# EAGLE design Qwiic_Adaptive_Switch_Output (EAGLE 9.6.2)
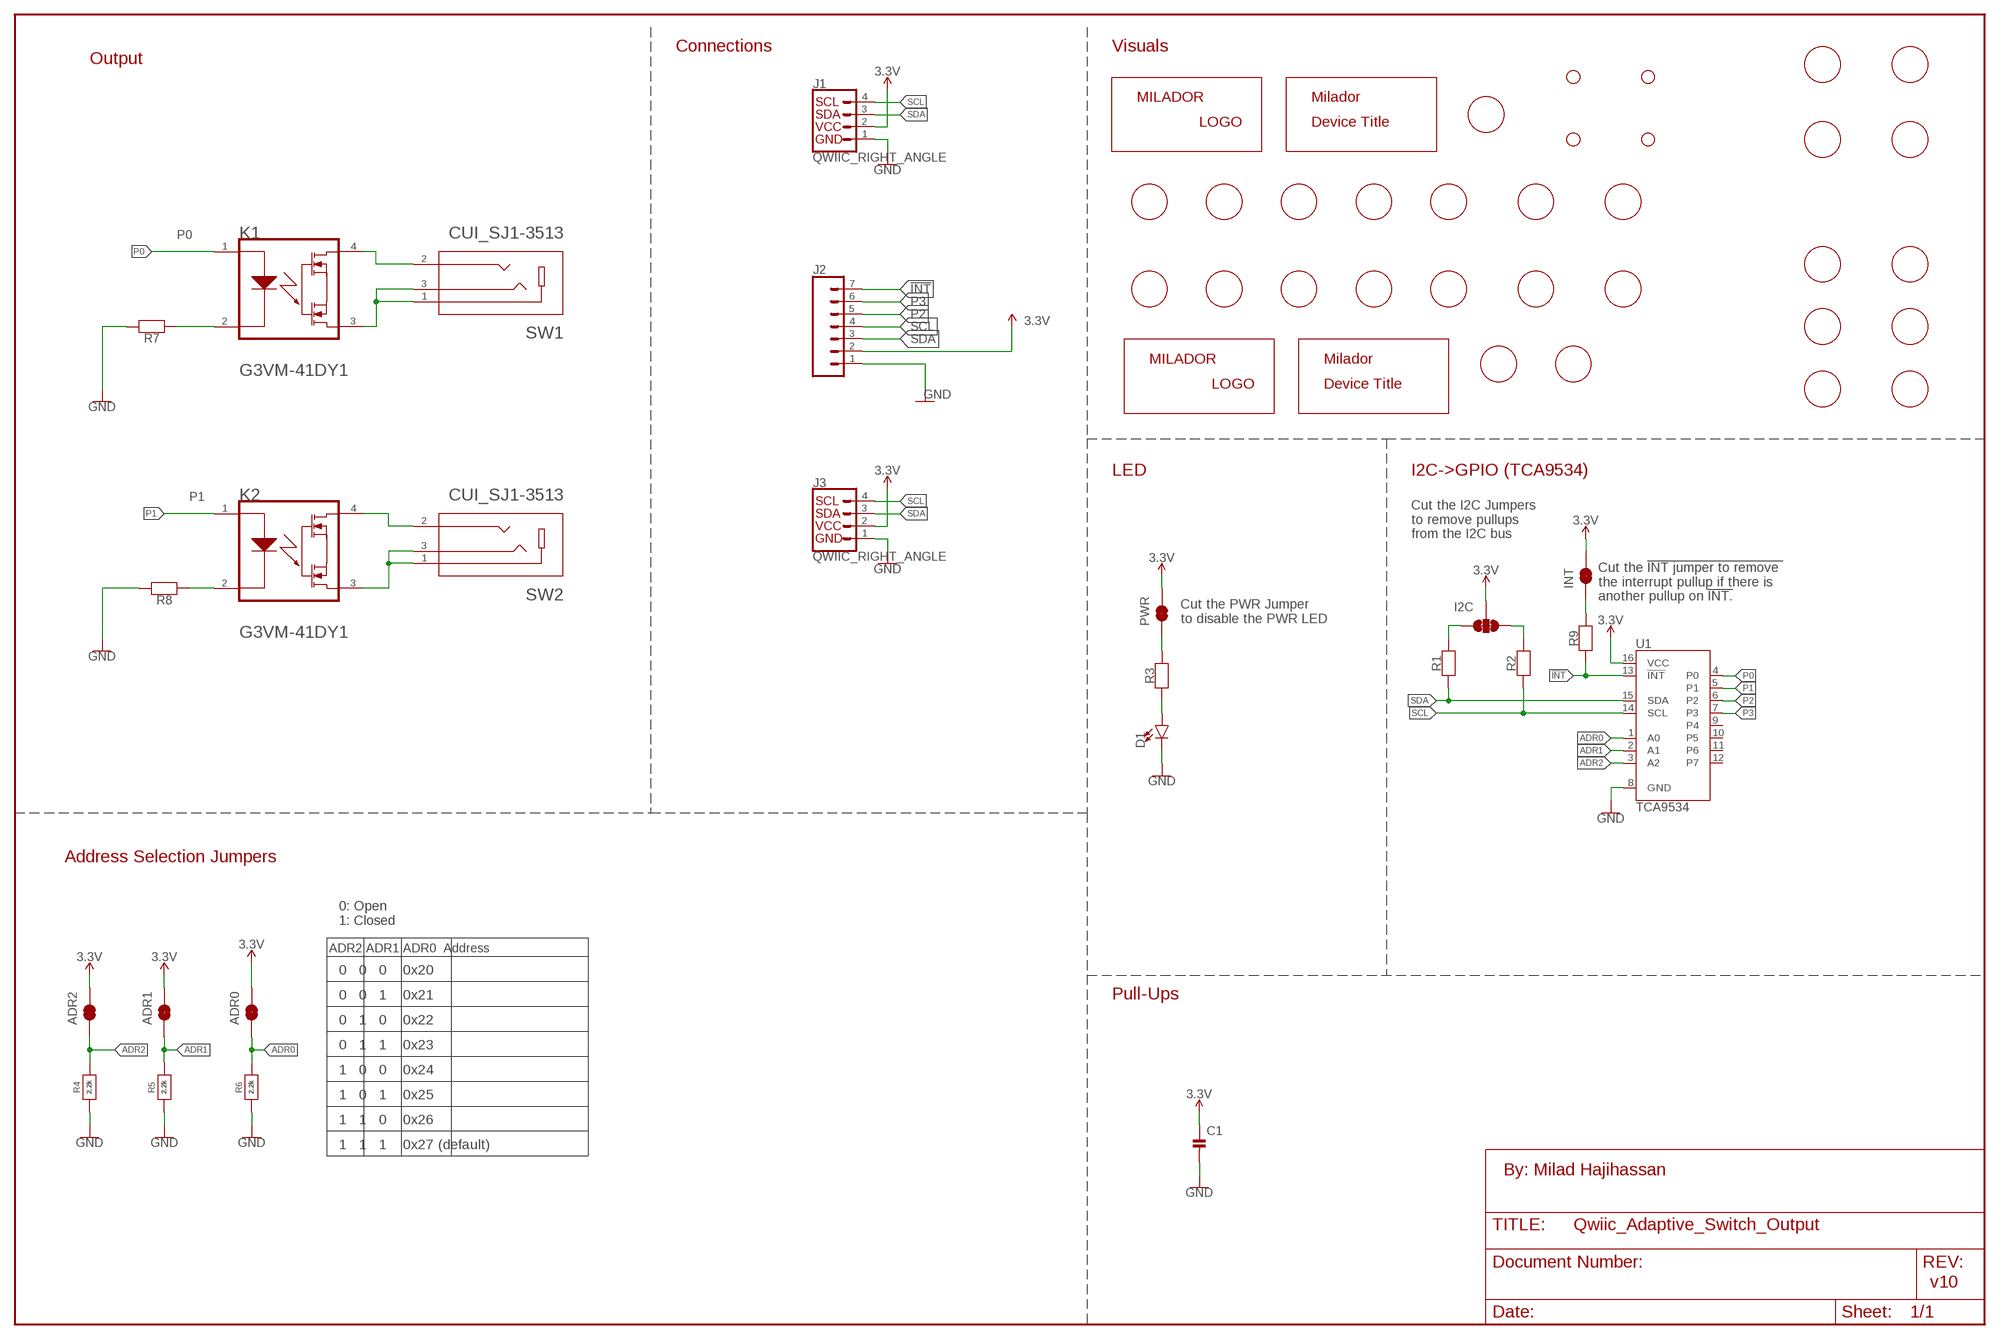
[diagram p0: schematic, sheet 1]

## Parts
ADR0  JUMPERS-SMT_2_NC_TRACE_SILK  [JUMPERS_SMT-JUMPER_2_NC_TRACE_SILK]
ADR1  JUMPERS-SMT_2_NC_TRACE_SILK  [JUMPERS_SMT-JUMPER_2_NC_TRACE_SILK]
ADR2  JUMPERS-SMT_2_NC_TRACE_SILK  [JUMPERS_SMT-JUMPER_2_NC_TRACE_SILK]
C1  0.1uF  CAP_CERAMIC-0805-MP  [0805-MP]
D1  RED  LED0805_NOOUTLINE  [CHIPLED_0805_NOOUTLINE]
H1  STAND-OFF-3.3  [STAND-OFF-3.3]
H2  STAND-OFF-3.3  [STAND-OFF-3.3]
H3  STAND-OFF-3.3  [STAND-OFF-3.3]
H4  STAND-OFF-3.3  [STAND-OFF-3.3]
I2C  JUMPERS_JUMPER-SMT_3_2-NC_TRACE_SILK  [JUMPERS_SMT-JUMPER_3_2-NC_TRACE_SILK]
INT  JUMPERS-SMT_2_NC_TRACE_SILK  [JUMPERS_SMT-JUMPER_2_NC_TRACE_SILK]
J1  QWIIC_RIGHT_ANGLE  QWIIC_CONNECTORSJS-1MM  [CONNECTORS_JST04_1MM_RA]
J2  CONNECTORS_CONN_071X07_NO_SILK  [CONNECTORS_1X07_NO_SILK]
J3  QWIIC_RIGHT_ANGLE  QWIIC_CONNECTORSJS-1MM  [CONNECTORS_JST04_1MM_RA]
K1  G3VM-41DY1  [G3VM-41DY1]
K2  G3VM-41DY1  [G3VM-41DY1]
LABE_SCL_BOTTOM  MILADOR-LABEL-SCL  [LABEL-SCL]
LABE_SCL_TOP  MILADOR-LABEL-SCL  [LABEL-SCL]
LABE_SDA_BOTTOM  MILADOR-LABEL-SDA  [LABEL-SDA]
LABE_SDA_TOP  MILADOR-LABEL-SDA  [LABEL-SDA]
LABEL_3V_BOTTOM  MILADOR-LABEL-3V  [LABEL-3V]
LABEL_3V_TOP  MILADOR-LABEL-3V  [LABEL-3V]
LABEL_!INT_BOTTOM  MILADOR-LABEL-!INT  [LABEL-!INT]
LABEL_!INT_TOP  MILADOR-LABEL-!INT  [LABEL-!INT]
LABEL_ADR0  MILADOR-LABEL-ADR0  [LABEL-ADR0]
LABEL_ADR1  MILADOR-LABEL-ADR1  [LABEL-ADR1]
LABEL_ADR2  MILADOR-LABEL-ADR2  [LABEL-ADR2]
LABEL_GND_BOTTOM  MILADOR-LABEL-GND  [LABEL-GND]
LABEL_GND_TOP  MILADOR-LABEL-GND  [LABEL-GND]
LABEL_I2C  MILADOR-LABEL-I2C  [LABEL-I2C]
LABEL_I2C_ADDRESS  MILADOR-LABEL-ADDRESS-0X27  [LABEL-ADDRESS-27]
LABEL_INT  MILADOR-LABEL-INT  [LABEL-INT]
LABEL_MILADOR_BOTTOM  MILADOR-LOGO-  [MILADOR_LOGO1]
LABEL_MILADOR_TOP  MILADOR-LOGO-  [MILADOR_LOGO1]
LABEL_OUTPUT_BOTTOM  MILADOR-SWITCH-NAME-SW-OUTPUT  [SWITCH-OUTPUT]
LABEL_OUTPUT_TOP  MILADOR-SWITCH-NAME-SW-OUTPUT  [SWITCH-OUTPUT]
LABEL_P0_BOTTOM  MILADOR-LABEL-P0  [LABEL-P0]
LABEL_P1_BOTTOM  MILADOR-LABEL-P1  [LABEL-P1]
LABEL_P2_BOTTOM  MILADOR-LABEL-P2  [LABEL-P2]
LABEL_P2_TOP  MILADOR-LABEL-P2  [LABEL-P2]
LABEL_P3_BOTTOM  MILADOR-LABEL-P3  [LABEL-P3]
LABEL_P3_TOP  MILADOR-LABEL-P3  [LABEL-P3]
LABEL_PWR  MILADOR-LABEL-PWR  [LABEL-PWR]
LABEL_SW1  MILADOR-SWITCH-NAME-SW1  [SWITCH-SW1]
LABEL_SW2  MILADOR-SWITCH-NAME-SW2  [SWITCH-SW2]
LABEL_TITLE_BOTTOM  MILADOR-DEVICE-QWIIC-SWITCH  [MILADOR_QWIIC_SWITCH]
LABEL_TITLE_TOP  MILADOR-DEVICE-QWIIC-SWITCH-SM  [MILADOR_QWIIC_SWITCH_SM]
PWR  JUMPERS-SMT_2_NC_TRACE_SILK  [JUMPERS_SMT-JUMPER_2_NC_TRACE_SILK]
R1  2.2k  RESISTOR-0805-MP  [0805-MP]
R2  2.2k  RESISTOR-0805-MP  [0805-MP]
R3  1k  RESISTOR-0805-MP  [0805-MP]
R4  2.2k  RESISTOR-0805-MP  [0805-MP]
R5  2.2k  RESISTOR-0805-MP  [0805-MP]
R6  2.2k  RESISTOR-0805-MP  [0805-MP]
R7  220  RESISTOR-0805-MP  [0805-MP]
R8  220  RESISTOR-0805-MP  [0805-MP]
R9  10k  RESISTOR-0805-MP  [0805-MP]
SW1  CUI_SJ1-3513  [CUI_SJ1-3513]
SW2  CUI_SJ1-3513  [CUI_SJ1-3513]
U1  TCA9534  TCA9534DWR  [16SOIC]

## Nets
3.3V: ADR0.2 ADR1.2 ADR2.2 C1.1 I2C.2 INT.2 J1.2 J2.2 J3.2 PWR.2 U1.16(VCC)
!INT: J2.7 R9.1 U1.13(!INT)
ADR0: ADR0.1 R6.2 U1.1(A0)
ADR1: ADR1.1 R5.2 U1.2(A1)
ADR2: ADR2.1 R4.2 U1.3(A2)
GND: C1.2 D1.C J1.1 J2.1 J3.1 R4.1 R5.1 R6.1 R7.2 R8.2 U1.8(GND)
N$1: INT.1 R9.2
N$2: D1.A R3.1
N$3: PWR.1 R3.2
N$4: K1.4 SW1.2
N$5: K1.2 R7.1
N$6: K1.3 SW1.1 SW1.3
N$7: K2.2 R8.1
N$8: K2.4 SW2.2
N$9: K2.3 SW2.1 SW2.3
P0: K1.1 U1.4(P0)
P1: K2.1 U1.5(P1)
P2: J2.5 U1.6(P2)
P3: J2.6 U1.7(P3)
SCL: J1.4 J2.4 J3.4 R2.1 U1.14(SCL)
SCL_PU1: I2C.1 R1.2
SDA: J1.3 J2.3 J3.3 R1.1 U1.15(SDA)
SDA_PU1: I2C.3 R2.2
Unconnected: U1.9(P4) U1.10(P5) U1.11(P6) U1.12(P7)

## Notes on the sheet
- Connections | Visuals
- Output
- LED | I2C->GPIO (TCA9534)
- Cut the I2C Jumpers 
  to remove pullups 
  from the I2C bus
- Cut the !INT jumper to remove 
  the interrupt pullup if there is 
  another pullup on !INT.
- Cut the PWR Jumper
  to disable the PWR LED
- Address Selection Jumpers
- 0: Open
  1: Closed
- ADR2 ADR1 ADR0  Address
- 0   0   0    0x20
- 0   0   1    0x21 | Pull-Ups
- 0   1   0    0x22
- 0   1   1    0x23
- 1   0   0    0x24
- 1   0   1    0x25
- 1   1   0    0x26
- 1   1   1    0x27 (default)
- By: Milad Hajihassan
- v10

## Library data of the parts
ADR0 ADR1 ADR2 INT PWR = milador_SMD:JUMPERS-SMT_2_NC_TRACE: Normally closed trace jumper This jumper has a trace between two pads so it's normally closed (NC). Use a razor knife to open the connection. For best results follow the IPC guidelines for cutting traces: Cutout at least 0.063 mm (0.005 in). Remove all loose material to clean up the cut area. Seal the cut with an approved epoxy. Reapply solder to reclose the connection.
C1 = milador_SMD:CAP_CERAMIC-: Ceramic Capacitors For new designs, use the packages preceded by an '_' character since they are more reliable: The following footprints should be used on most boards: _0402 - Standard footprint for regular board layouts _0603 - Standard footprint for regular board layouts _0805 - Standard footprint for regular board layouts _1206 - Standard footprint for regular board layouts For extremely tight-pitch boards where space is at a premium, the following 'micro-pitch' footprints can be used (smaller pads, no silkscreen outline, etc.): _0402MP - Micro-pitch footprint for very dense/compact boards _0603MP - Micro-pitch footprint for very dense/compact boards _0805MP - Micro-pitch footprint for very dense/compact boards _1206MP - Micro-pitch footprint for very dense/compact boards
D1 = milador_SMD:LED: LED 0603 - 0603 Surface Mount Package 2mA: Green LED - Low Power (3.9mcd, 2ma, 1.7Vf) - Digikey: 475-2709-2-ND Orange LED - Low Power (9.8mcd, 2ma, 1.8Vf) - Digikey: 475-1194-2-ND Red LED - Low Power (5mcd, 2ma, 1.8Vf) - Digikey: 475-1195-2-ND Yellow LED - Low Power (7mcd, 2ma, 1.8Vf) - Digikey: 475-1196-2-ND 5mA: Blue LED - Low Power (17mcd, 5ma, 2.9Vf) - Digikey: LNJ937W8CRACT-ND 0805 - 0805 Surface Mount Package 2mA: Red LED (8.8mcd, 2mA, 1.8Vf, Clear) - Low Power [Digikey: 475-2510-1-ND] Green LED (5mcd, 2mA, 1.8Vf, Clear) - Low Power [Digikey: 475-2730-1-ND] Yellow LED (11.3mcd, 2mA, 1.8Vf, Clear) - Low Power [Digikey: 475-2555-1-ND] 20mA: Red LED (104mcd, 20mA, Diffused) - LS R976 [Digikey: 475-1278-6-ND] Red LED (12mcd, 20mA, 2.0Vf, Clear) - APT2012EC [Digikey: 754-1128-1-ND] Green LED (15mcd, 20mA, 2.2Vf, Clear) - APT2012GC [Digikey: 754-1131-1-ND] Orange LED (160mcd, 20mA, 2.1Vf, Clear) - APT2012SECK [Digikey: 754-1130-1-ND] 1206 - 1206 Surface Mount Package Green LED (26mcd, 20mA, Diffused) - LG N971 [Digikey: 475-1407-6-ND] Red LED (15mcd, 20mA, Diffused) - LH N974 [Digikey: 475-1416-6-ND] Cree - Cree High-Power Surface Mount LEDs XPEBWT-L1-0000-00D50 - White 111lm 350mA 2.9Vf 6200K 110° XTEAWT-00-0000-00000LEE3 - White 114lm 350mA 2.85Vf 5000K 115° Everlight - Everlight 45-21 Series Surface Mount LEDs 45-21/QK2C-B2832AC2CB2/2T - Warm White 2000mcd 20mA 3.25Vf 3050K 120° 45-21/LK2C-B38452C4CB2/2T - Nuetral White 2000mcd 20mA 3.25Vf 4150K 120° 45-21/LK2C-B50634C6CB2/2T - Cold White 2200mcd 20mA 3.25Vf 5650K 120° PLCC2 Reverse Mount LS T77K-J1L2-1-0-2-R18-Z - Red 11.25mcd 2mA 1.8Vf 630nm 120° LO T77K-L1M2-24-Z - Orange 19.6mcd 2mA 1.8Vf 606nm 120° LY T77K-K2M1-26-Z - Yellow 15.7mcd 2mA 1.8Vf 587nm 120°
H1-H4 = milador:STAND-OFF-: Stand Off Drill holes for mechanically mounting via screws, standoffs, etc. Note: Use the keepout ring to avoid running the screw head into surrounding components. Variant Overviews STAND-OFF - Mechanical footprint for a #4 phillips button head screw. STAND-OFF-TIGHT - Mechanical footprint for a #4 phillips button head screw, Example SparkFun Products Screw - Phillips Head (1/4", 4-40, 10 pack) <https://www.sparkfun.com/products/10453> (PRT-10453) Screw - Phillips Head (1/2", 4-40, 10 pack) <https://www.sparkfun.com/products/10452> (PRT-10452) Screw - Phillips Head (3/4", 4-40, 10 pack) <https://www.sparkfun.com/products/10451> (PRT-10451) Screw - Phillips Head (1", 4-40, 10 pack) <https://www.sparkfun.com/products/10450> (PRT-10450)
I2C = milador_SMD:JUMPERS_JUMPER-SMT_3_2-NC_TRACE: Normally closed trace jumper (2 of 2 connections) This jumper has a trace between all three pads so they are normally closed (NC). Use a razor knife to open the connection(s). For best results follow the IPC guidelines for cutting traces: Cutout at least 0.063 mm (0.005 in). Remove all loose material to clean up the cut area. Seal the cut with an approved epoxy. Reapply solder to reclose the connection(s).
J1 J3 = milador_SMD:QWIIC_CONNECTORS: SparkFun I2C Standard Qwiic Connector An SMD 1mm pitch JST connector makes it easy and quick (get it? Qwiic?) to connect I2C devices to each other. The Qwiic system <http://www.sparkfun.com/qwiic> enables fast and solderless connection between popular platforms and various sensors and actuators. We carry 200mm <https://www.sparkfun.com/products/14204>, 100mm <https://www.sparkfun.com/products/14205>, 50mm <https://www.sparkfun.com/products/14206>, and breadboard friendly <https://www.sparkfun.com/products/14207> Qwiic cables. We also offer 10 pcs strips <https://www.sparkfun.com/products/14323> the SMD connectors.; PROD_ID: CONN-13694
J2 = milador:CONNECTORS_CONN_07: Multi connection point. Often used as Generic Header-pin footprint for 0.1 inch spaced/style header connections On any of the 0.1 inch spaced packages, you can populate with these: Break Away Headers - Straight <https://www.sparkfun.com/products/116> (PRT-00116) Break Away Male Headers - Right Angle <https://www.sparkfun.com/products/553> (PRT-00553) Female Headers <https://www.sparkfun.com/products/115> (PRT-00115) Break Away Headers - Machine Pin <https://www.sparkfun.com/products/117> (PRT-00117) Break Away Female Headers - Swiss Machine Pin <https://www.sparkfun.com/products/743> (PRT-00743) For SCREWTERMINALS and SPRING TERMINALS visit here: Screw Terimnals on SparkFun.com <https://www.sparkfun.com/search/results?term=Screw+Terminals> (5mm/3.5mm/2.54mm spacing) This device is also useful as a general connection point to wire up your design to another part of your project. Our various solder wires solder well into these plated through hole pads. Hook-Up Wire - Assortment (Stranded, 22 AWG) <https://www.sparkfun.com/products/11375> (PRT-11375) Hook-Up Wire - Assortment (Solid Core, 22 AWG) <https://www.sparkfun.com/products/11367> (PRT-11367) View the entire wire category on our website here <https://www.sparkfun.com/categories/141> Special notes: Molex polarized connector foot print use with SKU : PRT-08231 with associated crimp pins and housings. 1MM SMD Version SKU: PRT-10208
K1 K2 = milador_SMD:G3VM-41DY1: G3VM-41DY1(TR05)
LABE_SCL_BOTTOM LABE_SCL_TOP LABE_SDA_BOTTOM LABE_SDA_TOP LABEL_3V_BOTTOM LABEL_3V_TOP LABEL_!INT_BOTTOM LABEL_!INT_TOP LABEL_ADR0 LABEL_ADR1 LABEL_ADR2 LABEL_GND_BOTTOM LABEL_GND_TOP LABEL_I2C LABEL_I2C_ADDRESS LABEL_INT LABEL_P0_BOTTOM LABEL_P1_BOTTOM LABEL_P2_BOTTOM LABEL_P2_TOP LABEL_P3_BOTTOM LABEL_P3_TOP LABEL_PWR = milador:MILADOR-LABEL-
LABEL_MILADOR_BOTTOM LABEL_MILADOR_TOP = milador:MILADOR-LOGO-
LABEL_OUTPUT_BOTTOM LABEL_OUTPUT_TOP LABEL_SW1 LABEL_SW2 = milador:MILADOR-SWITCH-NAME-
LABEL_TITLE_BOTTOM LABEL_TITLE_TOP = milador:MILADOR-DEVICE-
R1-R9 = milador_SMD:RESISTOR-: Resistors For new designs, use the packages preceded by an '_' character since they are more reliable: The following footprints should be used on most boards: _0402 - Standard footprint for regular board layouts _0603 - Standard footprint for regular board layouts _0805 - Standard footprint for regular board layouts _1206 - Standard footprint for regular board layouts For extremely tight-pitch boards where space is at a premium, the following 'micro-pitch' footprints can be used (smaller pads, no silkscreen outline, etc.): _0402MP - Micro-pitch footprint for very dense/compact boards _0603MP - Micro-pitch footprint for very dense/compact boards _0805MP - Micro-pitch footprint for very dense/compact boards _1206MP - Micro-pitch footprint for very dense/compact boards
SW1 SW2 = MMC Eagle:CUI_SJ1-3513: SJ1-3513 3.50mm (0.141", 1/8", Mini Plug) - Headphone Phone Jack Stereo (3 Conductor, TRS) Connector. You can use these as jacks to create simple switch interfaces. Options: Digikey - CP1-3513-ND <https://www.digikey.ca/en/products/detail/SJ1-3513/CP1-3513-ND/738683> Mouser - 490-SJ1-3513 <https://www.mouser.ca/ProductDetail/CUI-Devices/SJ1-3513?qs=WyjlAZoYn505QJhcTd1fzA==>
U1 = milador_SMD:TCA9534: Texas Instruments TCA9534 I2C -> GPIO Expander This I2C -> GPIO Expander allows you to attach 8 GPIO to your I2C bus. With 8 different addresses, up to 64 GPIO are possible on one I2C bus; PROD_ID: IC-14889

## Board
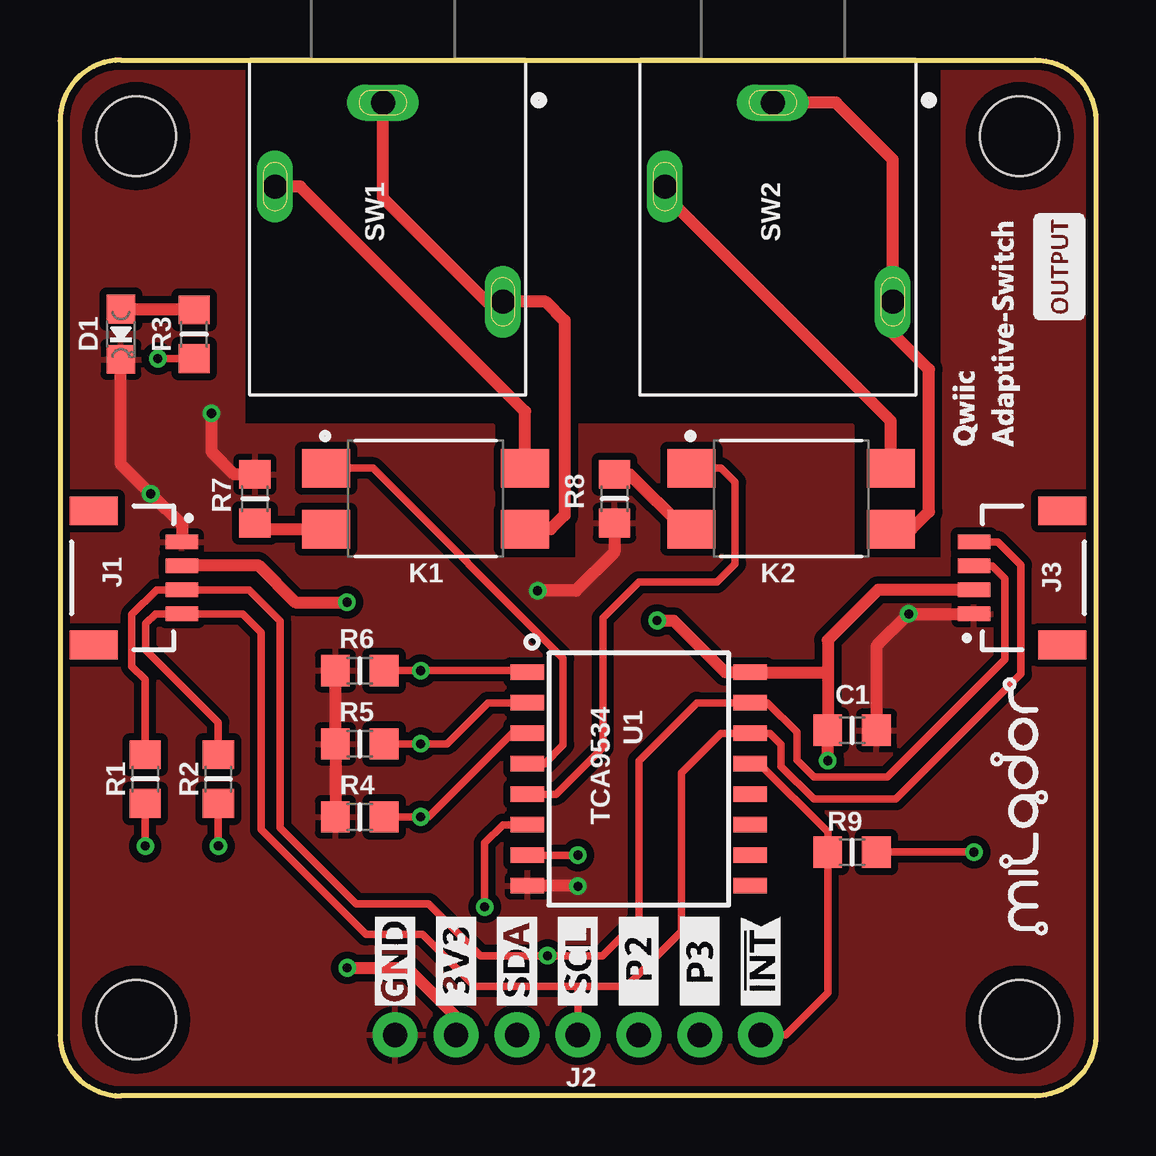
[diagram p1: board, top side]
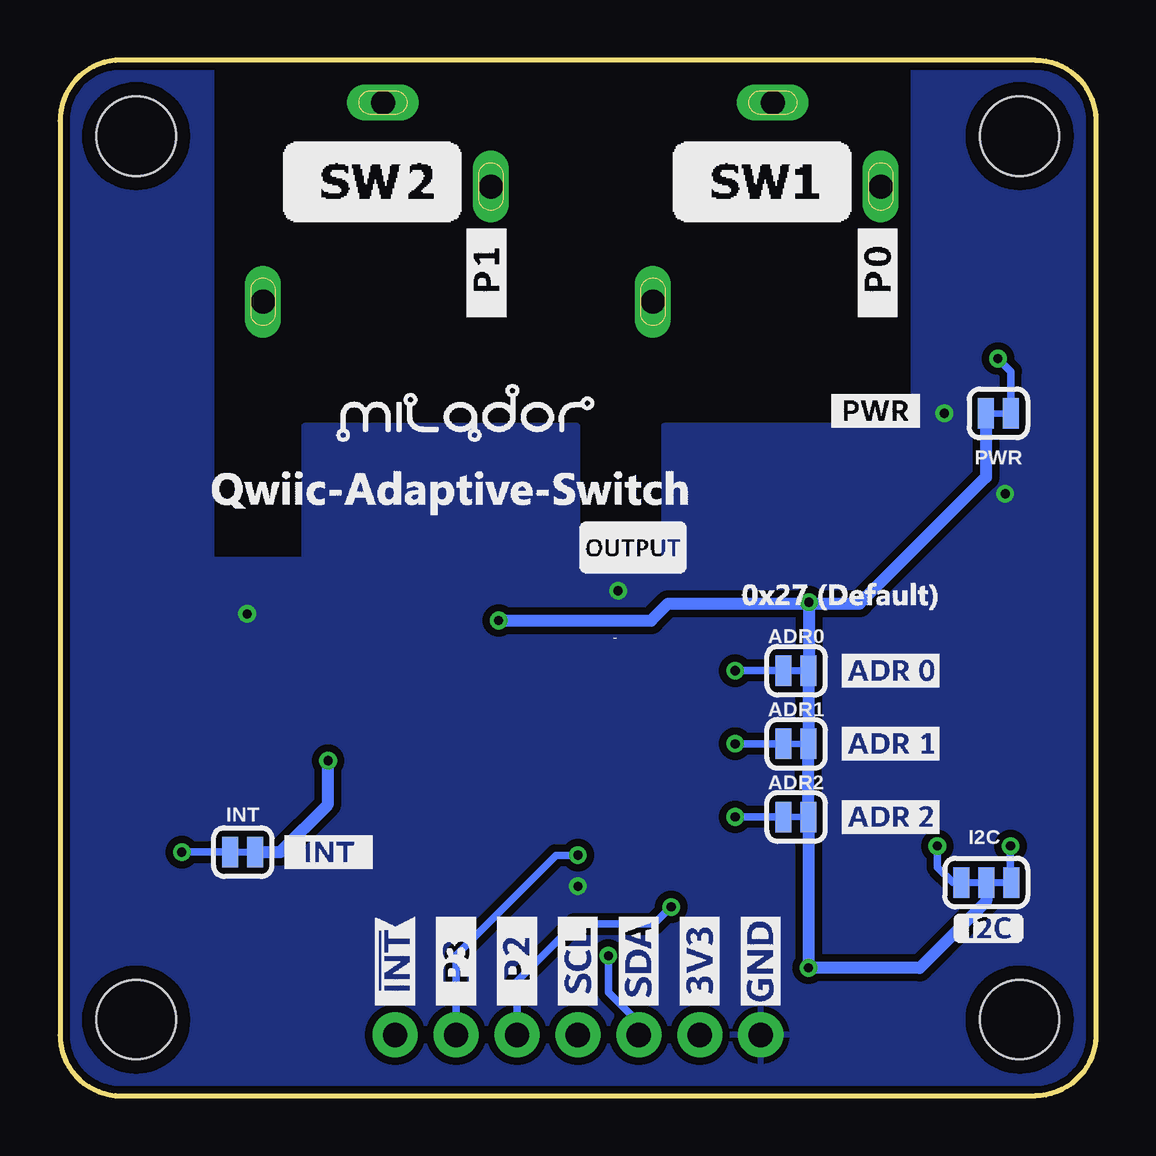
[diagram p2: board, bottom side, seen from below]

Size 43.18 x 43.18 mm. Coordinates in mm from the lower left corner, seen from the top.
Outline: 2.54,43.18 40.64,43.18 arc-90 43.18,40.64 43.18,2.54 arc-90 40.64,0 2.54,0 arc-90 0,2.54 0,40.64 arc-90 2.54,43.18
Copper layers (1*16): Top 0.035mm / dielectric 1.5mm / Bottom 0.035mm
Design rules "SparkFun-2-layer-TIGHT *": minimum track width 7mil, minimum drill 15mil, track to track 1mil, track to pad 1mil, pad to pad 1mil, via to via 1mil, smd to smd 1mil, copper to edge 7mil, drill to drill 7mil, minimum pad ring 7mil, minimum via ring 7mil, stop-mask expansion 4mil, vias tented up to drill 25mil, thermal gap 10mil

### Footprints (pad centres in the part's own frame; a part is rotated, then mirrored left to right if it is on the bottom)
JUMPERS_SMT-JUMPER_2_NC_TRACE_SILK = smd 0.66 x 1.27: 1 -0.521,0; 2 0.521,0
0805-MP = smd 1.2 x 1.3: 1 -1.016,0; 2 1.016,0
CHIPLED_0805_NOOUTLINE = smd 1.2 x 1.2: A 0,-1.05; C 0,1.05
STAND-OFF-3.3 = hole 3.302: 0,0
JUMPERS_SMT-JUMPER_3_2-NC_TRACE_SILK = smd 0.66 x 1.27: 1 -1.041,0; 2 0,0; 3 1.041,0
CONNECTORS_JST04_1MM_RA = smd 0.6 x 1.35: 1 -1.5,0; 2 -0.5,0; 3 0.5,0; 4 1.5,0 | smd 1.2 x 2: NC1 2.8,-3.675; NC2 -2.8,-3.675
CONNECTORS_1X07_NO_SILK = drill 1.016 pad 1.88: 1 0,0; 2 2.54,0; 3 5.08,0; 4 7.62,0; 5 10.16,0; 6 12.7,0; 7 15.24,0
G3VM-41DY1 = smd 2 x 1.6: 1 -4.15,1.27; 2 -4.15,-1.27; 3 4.15,-1.27; 4 4.15,1.27
CUI_SJ1-3513 = drill 1 long: 1 0,0; 2 3.5,-4.5; 3 8.3,5
16SOIC = smd 1.397 x 0.648: 1 -4.65,4.445; 2 -4.65,3.175; 3 -4.65,1.905; 4 -4.65,0.635; 5 -4.65,-0.635; 6 -4.65,-1.905; 7 -4.65,-3.175; 8 -4.65,-4.445; 9 4.65,-4.445; 10 4.65,-3.175; 11 4.65,-1.905; 12 4.65,-0.635; 13 4.65,0.635; 14 4.65,1.905; 15 4.65,3.175; 16 4.65,4.445

### Placement (x,y rotation side)
ADR0  12.5,17.72 0 bottom
ADR1  12.5,14.67 0 bottom
ADR2  12.5,11.63 0 bottom
C1  33.02,15.24 0 top
D1  2.54,31.75 180 top
H1  3.17,3.17 0 top
H2  3.17,40.01 0 top
H3  40.01,40.01 0 top
H4  40.01,3.17 0 top
I2C  4.57,8.89 180 bottom
INT  35.56,10.16 0 bottom
J1  5.08,21.59 270 top
J2  13.97,2.54 0 top
J3  38.1,21.59 90 top
K1  15.24,24.89 0 top
K2  30.48,24.89 0 top
LABE_SCL_BOTTOM  21.59,3.81 90 bottom
LABE_SCL_TOP  21.59,3.81 90 top
LABE_SDA_BOTTOM  19.05,3.81 90 bottom
LABE_SDA_TOP  19.05,3.81 90 top
LABEL_3V_BOTTOM  16.51,3.81 90 bottom
LABEL_3V_TOP  16.51,3.81 90 top
LABEL_!INT_BOTTOM  29.21,3.81 90 bottom
LABEL_!INT_TOP  29.21,3.81 90 top
LABEL_ADR0  10.54,17.72 0 bottom
LABEL_ADR1  10.54,14.67 0 bottom
LABEL_ADR2  10.54,11.63 0 bottom
LABEL_GND_BOTTOM  13.97,3.81 90 bottom
LABEL_GND_TOP  13.97,3.81 90 top
LABEL_I2C  5.87,6.99 0 bottom
LABEL_I2C_ADDRESS  10.67,20.83 0 bottom
LABEL_INT  33.78,10.16 0 bottom
LABEL_MILADOR_BOTTOM  41.15,12.19 90 top
LABEL_MILADOR_TOP  26.16,27.3 0 bottom
LABEL_OUTPUT_BOTTOM  19.3,22.86 0 bottom
LABEL_OUTPUT_TOP  41.66,34.54 90 top
LABEL_P0_BOTTOM  9.09,32.51 90 bottom
LABEL_P1_BOTTOM  25.4,32.51 90 bottom
LABEL_P2_BOTTOM  24.13,3.81 90 bottom
LABEL_P2_TOP  24.13,3.81 90 top
LABEL_P3_BOTTOM  26.67,3.81 90 bottom
LABEL_P3_TOP  26.67,3.81 90 top
LABEL_PWR  10.97,28.55 0 bottom
LABEL_SW1  13.91,38.1 0 bottom
LABEL_SW2  30.16,38.1 0 bottom
LABEL_TITLE_BOTTOM  26.92,25.15 0 bottom
LABEL_TITLE_TOP  38.61,31.75 90 top
PWR  4.06,28.45 180 bottom
R1  3.56,13.21 270 top
R2  6.6,13.21 270 top
R3  5.59,31.75 270 top
R4  12.5,11.63 0 top
R5  12.5,14.67 0 top
R6  12.5,17.72 0 top
R7  8.13,24.89 90 top
R8  23.11,24.89 270 top
R9  33.02,10.16 0 top
SW1  13.46,41.4 270 top
SW2  29.72,41.4 270 top
U1  24.13,13.21 0 top

### Tracks (layer width: path | path; a pad name or v marks a point on that pad's centre or on a via)
3.3V  (via drill 0.38)
  Top 0.508: v32,13.97 C1.1 32,17.65 | 32,17.65 U1.16 27.74,17.65 25.58,19.81 v24.89,19.81 | J3.2 34.09,21.09 32,19 32,17.65 | v11.96,20.57 9.8,20.57 8.26,22.12 5.11,22.12 J1.2 | v11.98,5.33 14.48,5.33 16.51,3.3 J2.2
  Bottom 0.178: ADR1.2 11.96,14.69 | 11.96,17.71 ADR0.2
  Bottom 0.508: ADR1.2 ADR2.2 v11.98,5.33 7.34,5.33 4.57,8.1 I2C.2 | 11.96,14.69 11.96,17.71 11.99,17.73 11.96,17.76 v11.96,20.57 11.91,20.52 | INT.2 34,10.16 32,12.16 v32,13.97 | PWR.2 4.58,25.79 9.86,20.52 11.91,20.52 | v24.89,19.81 18.54,19.81 17.83,20.52 11.91,20.52
!INT
  Top 0.305: J2.7 30.25,2.54 32,4.29 R9.1 32,11 29.16,13.84 U1.13
ADR0  (via drill 0.38)
  Top 0.305: R6.2 v15.04,17.72 19.41,17.72 U1.1
  Bottom 0.305: ADR0.1 v15.04,17.72
ADR1  (via drill 0.38)
  Top 0.305: U1.2 17.84,16.38 16.13,14.68 v15.04,14.68 14.33,14.68 14.2,14.68 R5.2
  Bottom 0.305: ADR1.1 v15.04,14.68
ADR2  (via drill 0.38)
  Top 0.305: R4.2 v15.04,11.63 15.36,11.63 18.85,15.11 U1.3
  Bottom 0.305: ADR2.1 v15.04,11.63
GND  (via drill 0.38)
  Top 0.508: R4.1 R5.1 R6.1 | J1.1 5.11,23.11 5.11,23.77 v3.78,25.09 2.54,26.34 D1.C | J3.1 v35.38,20.09 34.04,18.75 C1.2 | v21.59,8.74 21.57,8.76 U1.8 | R8.2 23.11,22.66 21.51,21.06 v19.91,21.06 | R7.2 7.26,25.91 6.31,26.86 v6.31,28.45
  pour Bottom (isolate 0.305): 0,43.18 7.62,43.18 7.62,27.94 18.03,27.94 18.03,22.35 21.59,22.35 21.59,27.94 33.02,27.94 33.02,22.35 36.83,22.35 36.83,43.18 43.18,43.18 43.18,0 0,0
  pour Top (isolate 0.305): 0,43.18 7.62,43.18 7.62,27.94 18.03,27.94 18.03,22.35 21.59,22.35 21.59,27.94 33.02,27.94 33.02,22.35 36.83,22.35 36.83,43.18 43.18,43.18 43.18,0 0,0
N$1  (via drill 0.38)
  Top 0.305: v38.1,10.16 R9.2
  Bottom 0.305: v38.1,10.16 INT.1
N$2
  Top 0.508: D1.A 5.55,32.8 R3.1
N$3  (via drill 0.38)
  Top 0.254: R3.2
  Top 0.305: R3.2 v4.08,30.73
  Bottom 0.305: v4.08,30.73 3.54,30.2 PWR.1
N$4
  Top 0.508: K1.4 19.39,28.52 10.01,37.9 SW1.2
N$5
  Top 0.508: R7.1 8.38,23.62 K1.2
N$6
  Top 0.508: K1.3 20.46,23.62 21.04,24.21 21.04,32.32 20.26,33.1 SW1.3 17.79,33.1 13.46,37.43 SW1.1
N$7
  Top 0.508: R8.1 23.75,25.91 26.04,23.62 K2.2
N$8
  Top 0.508: SW2.2 25.22,37.55 34.63,28.13 K2.4
N$9
  Top 0.508: SW2.1 32.35,41.4 34.72,39.03 SW2.3 34.72,31.78 36.22,30.28 36.22,24.35 35.49,23.62 K2.3
P0
  Top 0.305: U1.4 20.19,13.84 20.98,14.63 20.98,18.24 13.06,26.16 K1.1
P1
  Top 0.305: U1.5 20.68,12.57 22.63,14.53 22.63,19.91 24.13,21.41 27.38,21.41 28.14,22.17 28.14,25.58 27.56,26.16 K2.1
P2  (via drill 0.38)
  Top 0.305: U1.6 18.47,11.3 17.7,10.54 v17.7,7.87
  Bottom 0.305: v17.7,7.87 18.41,7.16 21.74,7.16 24.13,4.77 J2.5
P3  (via drill 0.38)
  Top 0.305: U1.7 v21.59,10.03
  Bottom 0.305: J2.6 26.67,5.87 22.5,10.03 v21.59,10.03
SCL
  Top 0.305: J3.4 39.09,23.09 40.06,22.12 40.06,17.58 34.85,12.37 31.42,12.37 30.05,13.74 30.05,14.66 29.59,15.11 U1.14 27.56,15.11 25.91,13.46 25.91,6.86 23.62,4.57 21.59,4.57 | R2.1 6.6,15.57 3.58,18.59 3.58,19.68 3.99,20.09 J1.4 7.62,20.09 8.38,19.32 8.38,11.1 12.75,6.73 15.11,6.73 17.27,4.57 21.59,4.57 | J2.4 21.59,4.57
SCL_PU1  (via drill 0.38)
  Top 0.305: v3.56,10.41 R1.2
  Bottom 0.254: 3.56,8.91 I2C.1
  Bottom 0.305: v3.56,10.41 3.56,8.91
SDA  (via drill 0.38)
  Top 0.305: J3.3 38.87,22.09 39.4,21.57 39.4,18.19 34.49,13.28 31.42,13.28 30.71,13.99 30.71,15.16 29.49,16.38 U1.15 26.54,16.38 24.13,13.97 24.13,7.37 22.61,5.84 v20.32,5.84 17.53,5.84 15.37,8 12.34,8 9.17,11.18 9.17,19.8 7.88,21.09 J1.3 4.02,21.09 3,20.07 3,17.91 3.56,17.35 R1.1
  Bottom 0.305: J2.3 19.05,3.05 20.32,4.32 v20.32,5.84
SDA_PU1  (via drill 0.38)
  Top 0.305: R2.2 v6.6,10.41
  Bottom 0.254: 5.97,8.89 I2C.3
  Bottom 0.305: v6.6,10.41 6.6,9.53 5.97,8.89